# Altium schematic sheet R5460.SchDoc
size A4; SheetNumber: 4; SheetTotal: 5
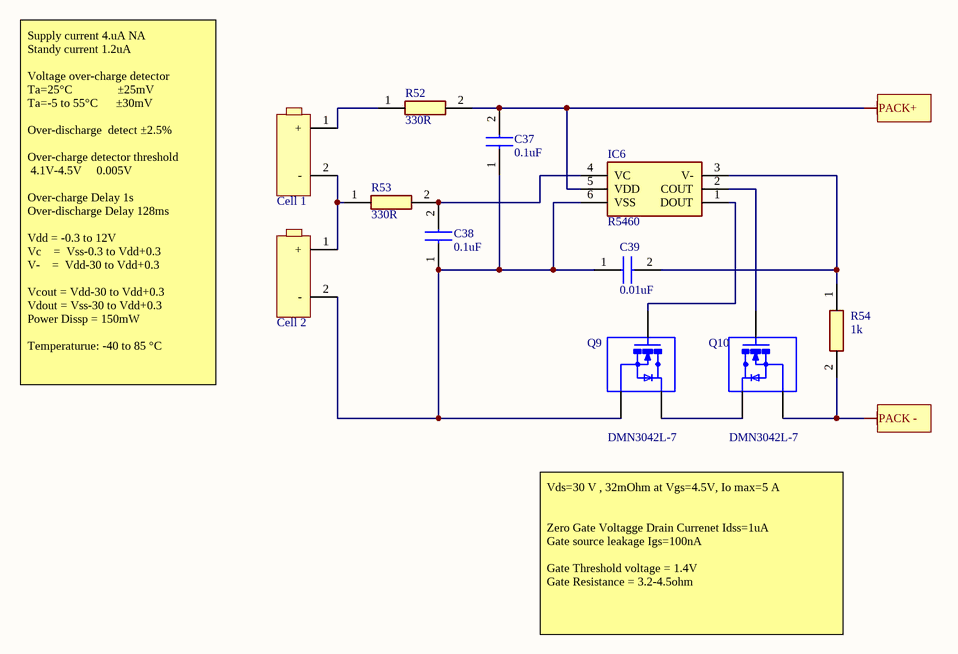
[diagram p0: R5460.SchDoc]

## Parts
C37  0.1uF  [CAPC3216X180N]
C38  0.1uF  [CAPC3216X180N]
C39  0.01uF  [CAPC3216X180N]
Cell_1  Cell  [Cell]  (value not drawn)
Cell_2  Cell  [Cell]  (value not drawn)
IC6  R5460  [SOT95P280X140-6N]
Q9  DMN3042L-7  [SOT91P240X110-3N]
Q10  DMN3042L-7  [SOT91P240X110-3N]
R52  330R  [RESC1608X55N]
R53  330R  [RESC1608X55N]
R54  1k  [RESC1608X55N]

## Nets
PACK -: Q10.2(SOURCE) R54.2
PACK+: C37.2 IC6.5(VDD) R52.2
NetC37_1: C37.1 C38.1 C39.1 Cell_2.2(-) IC6.6(VSS) Q9.2(SOURCE)
NetC38_2: C38.2 IC6.4(VC) R53.2
NetC39_2: C39.2 IC6.3(V-) R54.1
NetCell_1_1: Cell_1.1(+) R52.1
NetCell_1_2: Cell_1.2(-) Cell_2.1(+) R53.1
NetIC6_1: IC6.1(DOUT) Q9.1(GATE)
NetIC6_2: IC6.2(COUT) Q10.1(GATE)
NetQ9_3: Q9.3(DRAIN) Q10.3(DRAIN)

## Notes on the sheet
- Supply current 4.uA NA
  Standy current 1.2uA
  Voltage over-charge detector
  Ta=25°C               ±25mV
  Ta=-5 to 55°C      ±30mV
  Over-discharge  detect ±2.5%
  Over-charge detector threshold
  4.1V-4.5V     0.005V
  Over-charge Delay 1s
  Over-discharge Delay 128ms
  Vdd = -0.3 to 12V
  Vc    =  Vss-0.3 to Vdd+0.3
  V-    =  Vdd-30 to Vdd+0.3
  Vcout = Vdd-30 to Vdd+0.3
  Vdout = Vss-30 to Vdd+0.3
  Power Dissp = 150mW
  Temperaturue: -40 to 85 °C
- Vds=30 V , 32mOhm at Vgs=4.5V, Io max=5 A
  Zero Gate Voltagge Drain Currenet Idss=1uA
  Gate source leakage Igs=100nA
  Gate Threshold voltage = 1.4V
  Gate Resistance = 3.2-4.5ohm

## Library data of the parts
C37-C39 = GRM31CD80J107MEA8L: Capacitor; Manufacturer_Name: Murata Electronics; Height: 1.8mm; Manufacturer_Part_Number: GRM31CD80J107MEA8L; Mouser Part Number: 81-GRM31CD80J107MA8L; Mouser Price/Stock: https://www.mouser.co.uk/ProductDetail/Murata-Electronics/GRM31CD80J107MEA8L?qs=DPoM0jnrROWnWfPYsqocbw%3D%3D
IC6 = R5460N212AF-TR-FE: Integrated Circuit; Manufacturer_Name: Ricoh; Datasheet Link: https://eagle.componentsearchengine.com/Datasheets/1/R5460N212AF-TR-FE.pdf; Height: 1.4mm; Manufacturer_Part_Number: R5460N212AF-TR-FE; Mouser Part Number: 848-R5460N212AF-TR; Mouser Price/Stock: https://www.mouser.co.uk/ProductDetail/Ricoh-Electronic-Devices-Company/R5460N212AF-TR-FE?qs=vLWxofP3U2zA%252BWVvFiMalQ%3D%3D
Q9 Q10 = DMN3042L-7: N-Channel 30V 5.8A (Ta) 720mW (Ta) Surface Mount SOT-23; MF: Diodes Inc.; Value: *; Package: SOT-23-3 Diodes Inc.; Check_prices: https://www.snapeda.com/parts/DMN3042L-7/Diodes%20Inc./view-part/827647/?ref=eda; SnapEDA_Link: https://www.snapeda.com/parts/DMN3042L-7/Diodes%20Inc./view-part/827647/?ref=snap; Digi-Key_Part_Number: DMN3042L-7DICT-ND; MP: DMN3042L-7
R52-R54 = CR0603-FX-1003ELF: Resistor; Manufacturer_Name: Bourns; Datasheet Link: https://www.bourns.com/pdfs/chpreztr.pdf; Height: 0.55mm; Manufacturer_Part_Number: CR0603-FX-1003ELF; Mouser Part Number: 652-CR0603-FX-103ELF; Mouser Price/Stock: https://www.mouser.co.uk/ProductDetail/Bourns/CR0603-FX-1003ELF?qs=K5ddiUFZPT49r0RoKWcKqg%3D%3D; Arrow Part Number: CR0603-FX-1003ELF; Arrow Price/Stock: https://www.arrow.com/en/products/cr0603-fx-1003elf/bourns?region=europe